# EAGLE design power mux-v4 (EAGLE 6.5.0)
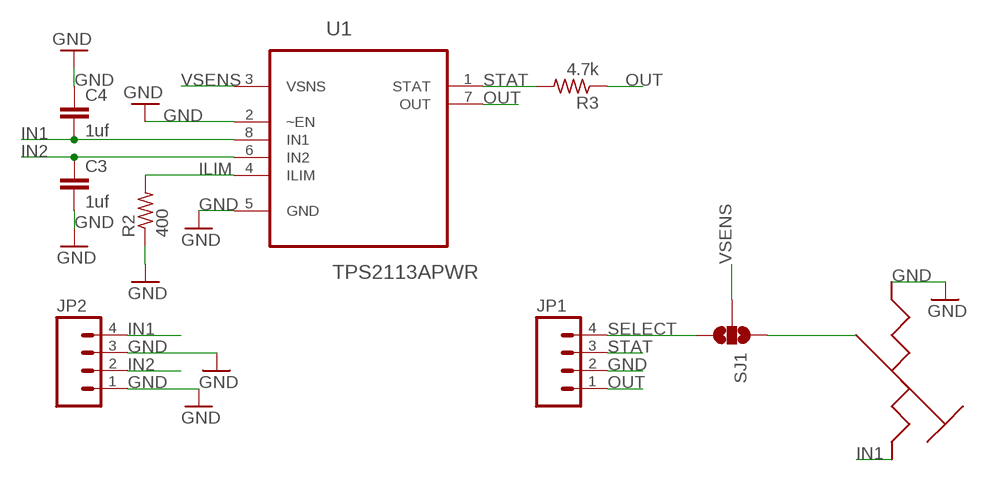
[diagram p0: schematic, sheet 1]

## Parts
C3  1uf  CAP0402-CAP  [0402-CAP]
C4  1uf  CAP0402-CAP  [0402-CAP]
JP1  M04PTH  [1X04]
JP2  M04PTH  [1X04]
R2  400  R-US_R0402  [R0402]
R3  4.7k  R-US_R0402  [R0402]
SJ1  SOLDERJUMPER_2WAYPASTE1&2  [SJ_3_PASTE1&2]
U1  TPS2113APWR  [SOP65P640X120-8N]
U$2  TRIMPOT-10K  [TRIMPOT-10K]

## Nets
GND: C3.2 C4.1 JP1.2 JP2.1 JP2.3 R2.1 U1.2(~EN) U1.5(GND) U$2.1(IN)
ILIM: R2.2 U1.4(ILIM)
IN1: C4.2 JP2.4 U1.8(IN1) U$2.2(OUT)
IN2: C3.1 JP2.2 U1.6(IN2)
N$2: SJ1.1 U$2.3(W)
OUT: JP1.1 R3.1 U1.7(OUT)
SELECT: JP1.4 SJ1.3
STAT: JP1.3 R3.2 U1.1(STAT)
VSENS: SJ1.2 U1.3(VSNS)

## Library data of the parts
C3 C4 = SparkFun-Capacitors:CAP: Capacitor Standard 0603 ceramic capacitor, and 0.1" leaded capacitor.
JP1 JP2 = SparkFun-Connectors:M04: Header 4 Standard 4-pin 0.1" header. Use with straight break away headers (SKU : PRT-00116), right angle break away headers (PRT-00553), swiss pins (PRT-00743), machine pins (PRT-00117), and female headers (PRT-00115). Molex polarized connector foot print use with SKU : PRT-08231 with associated crimp pins and housings. 1MM SMD Version SKU: PRT-10208
R2 R3 = resistor:R-US_: RESISTOR, American symbol
SJ1 = SparkFun-Passives:SOLDERJUMPER_2WAY: Solder Jumper 2 way solder jumper
U1 = Texas Instruments_By_element14_Batch_1:TPS2113APWR: AUTOSWITCHING POWER MUX; MPN: TPS2113APWR; OC_FARNELL: 1757288; OC_NEWARK: 01J0961; PACKAGE: TSSOP-8; SUPPLIER: TEXAS INSTRUMENTS
U$2 = Richards:TRIMPOT-10K

## Board
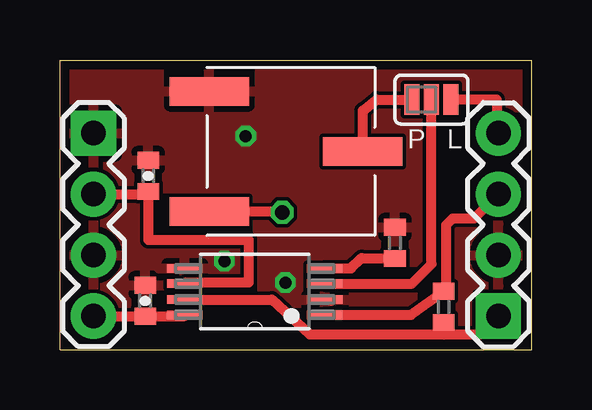
[diagram p1: board, top side]
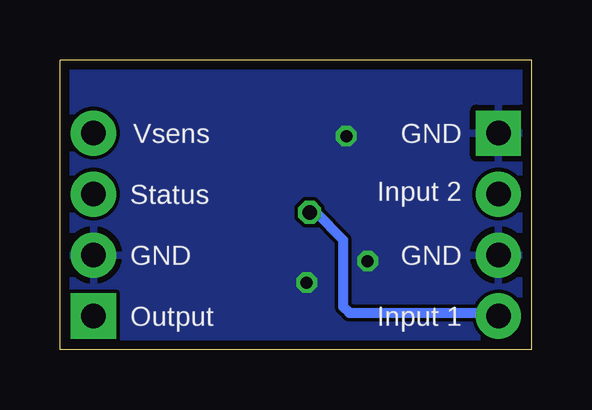
[diagram p2: board, bottom side, seen from below]

Size 19.68 x 12.06 mm. Coordinates in mm from the lower left corner, seen from the top.
Outline: 0,0 0,12.06 19.68,12.06 19.68,0 0,0
Copper layers (1*16): Top 0.0356mm / dielectric 1.5011mm / Bottom 0.0356mm
Design rules "LaenPCBOrder": minimum track width 6mil, minimum drill 13mil, track to track 6mil, track to pad 6mil, pad to pad 6mil, via to via 6mil, smd to smd 6mil, copper to edge 15mil, drill to drill 6mil, minimum pad ring 7mil, minimum via ring 7mil, stop-mask expansion 3mil, vias tented up to drill 0mil, thermal gap 10mil

### Footprints (pad centres in the part's own frame; a part is rotated, then mirrored left to right if it is on the bottom)
0402-CAP = smd 0.7 x 0.9: 1 -0.65,0; 2 0.65,0
1X04 = drill 1.016 pad 1.88 square: 1 0,0 | drill 1.016 pad 1.88: 2 2.54,0; 3 5.08,0; 4 7.62,0
R0402 = smd 0.7 x 0.9: 1 -0.65,0; 2 0.65,0
SJ_3_PASTE1&2 = smd 0.635 x 1.27: 1 -0.813,0; 2 0,0; 3 0.813,0
SOP65P640X120-8N = smd 1.473 x 0.356: 1 -2.921,0.965; 2 -2.921,0.33; 3 -2.921,-0.33; 4 -2.921,-0.965; 5 2.921,-0.965; 6 2.921,-0.33; 7 2.921,0.33; 8 2.921,0.965
TRIMPOT-10K = smd 1.19 x 3.3: 1 -2.5,-3.3; 2 2.5,-3.3; 3 0,3.1

### Placement (x,y rotation side)
C3  3.68,7.24 90 top
C4  3.56,2.03 270 top
JP1  18.29,1.4 90 top
JP2  1.4,9.02 270 top
R2  13.97,4.45 270 top
R3  16,1.78 90 top
SJ1  15.49,10.41 0 top
U1  8.13,2.41 180 top
U$2  9.53,8.26 270 top

### Tracks (layer width: path | path; a pad name or v marks a point on that pad's centre or on a via)
GND  (via drill 0.5)
  Top 0.406: U1.2 11.35,2.08 11.3,2.03
  other vias: 6.86,3.68 9.4,2.79 7.75,8.89
  pour Top: 0,0 19.56,0 19.56,12.06 0,12.06
  pour Bottom: 0,12.06 0,0 19.56,0 19.56,12.06
ILIM
  Top 0.406: U1.4 12.14,3.38 12.57,3.81 R2.2
IN1  (via drill 0.6)
  Top 0.406: C4.2 3.56,1.4 JP2.4 5.21,1.4 U1.8 | U$2.2 9.23,5.75 v9.27,5.71
  Bottom 0.406: v9.27,5.71 9.02,5.71 7.87,4.57 7.87,1.78 7.62,1.52 1.52,1.52 JP2.4
IN2
  Top 0.406: JP2.2 3.56,6.48 C3.1 3.7,6.46 3.68,6.1 3.68,4.57 7.87,4.57 7.87,2.79 5.26,2.79 U1.6
N$2
  Top 0.406: U$2.3 12.62,9.96 13.21,10.41 SJ1.1
OUT
  Top 0.406: U1.7 8.84,2.08 10.41,0.64 16.64,0.64 | 16.64,0.64 17.53,0.64 JP1.1 | R3.1 16.02,0.62 16.64,0.64
SELECT
  Top 0.406: JP1.4 18.21,10.41 SJ1.3
STAT
  Top 0.406: U1.1 14.64,1.45 R3.2 16.11,2.79 16.11,5.19 16.38,5.46 17.27,5.46 JP1.3
VSENS
  Top 0.406: U1.3 14.68,2.74 15.49,3.56 SJ1.2

### Text on the board
tPlace: P | L
bPlace: GND | Vsens | Input 2 | Status | GND | GND | Input 1 | Output